# Altium project MRD104_MICROBOARD_APPS_A.PrjPcb (part 2 of 2)

## Sheet 0003_Page 3.SchDoc
size 553 x 426 mm
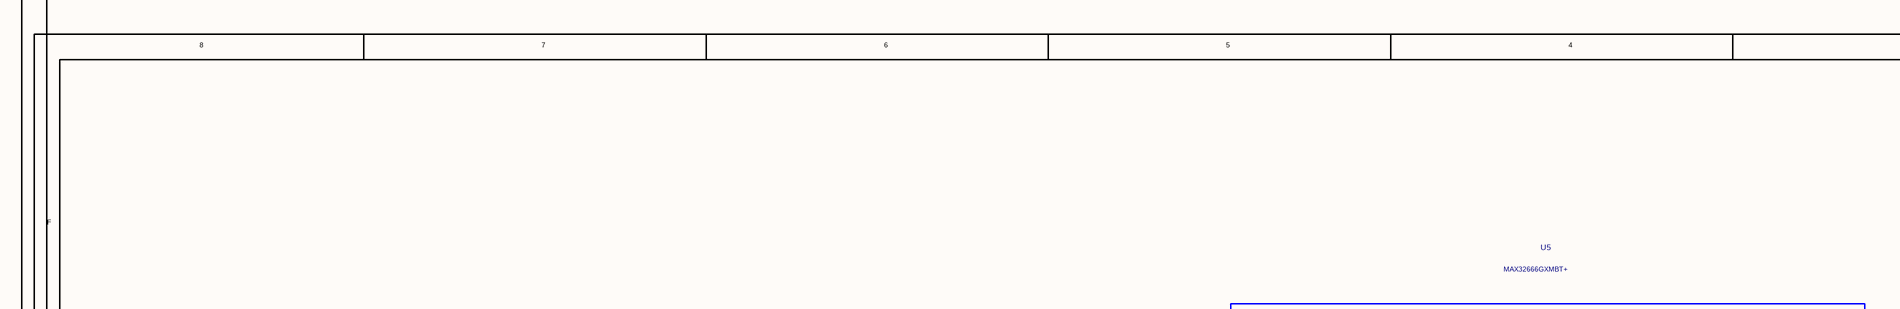
[diagram p7: 0003_Page 3.SchDoc, top left]
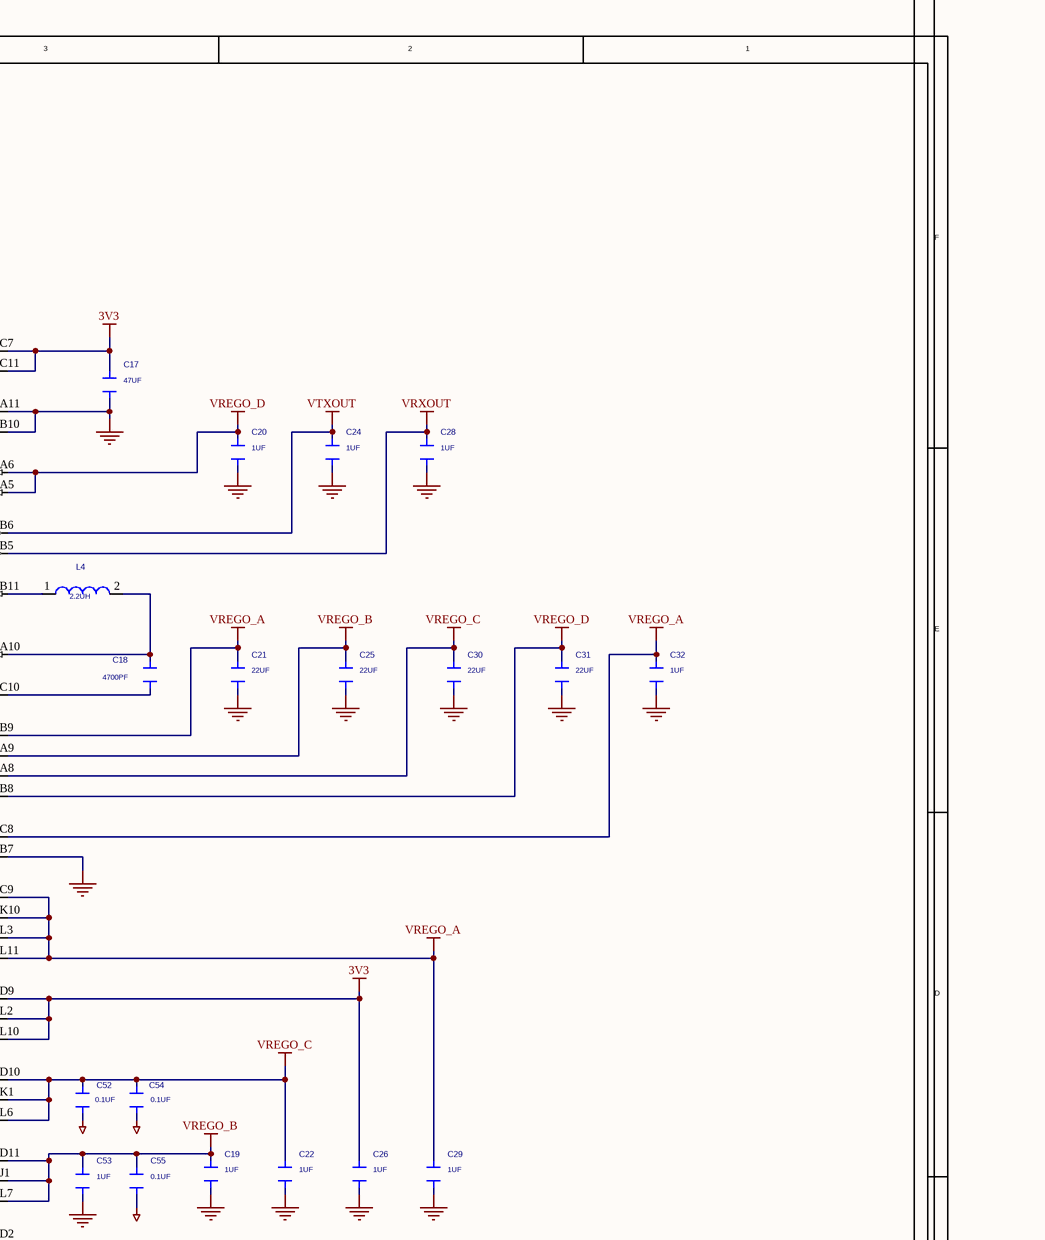
[diagram p8: 0003_Page 3.SchDoc, top middle]
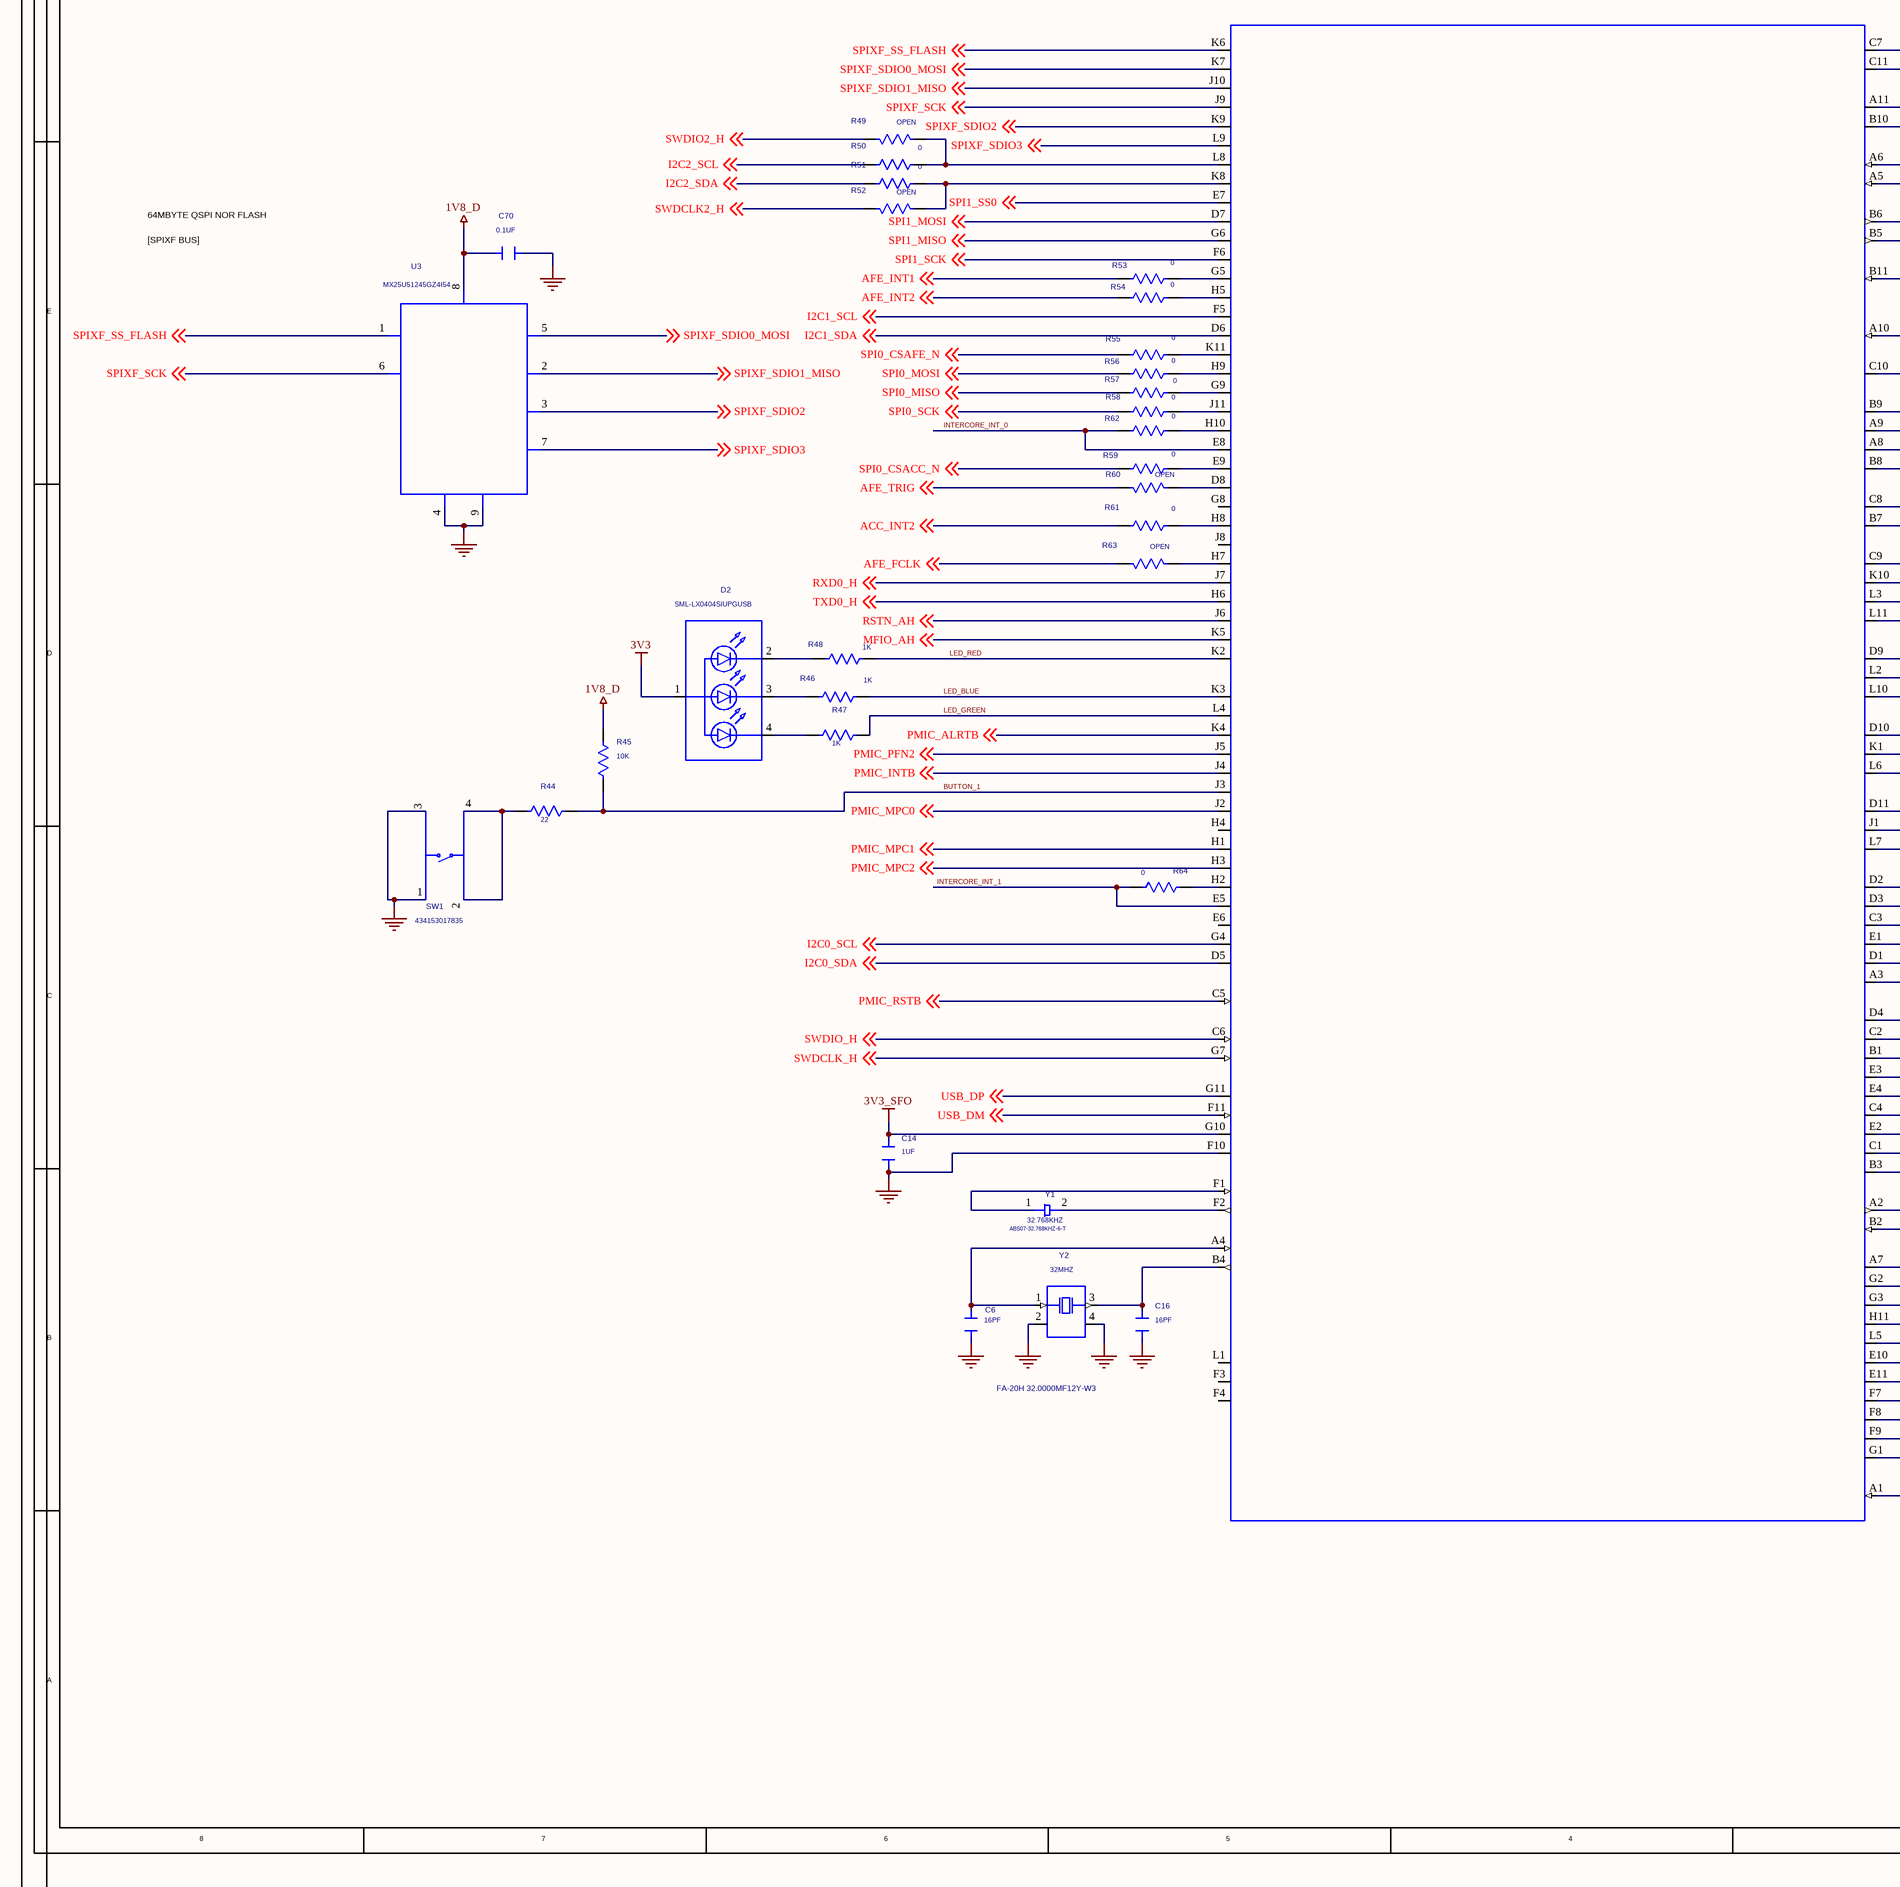
[diagram p9: 0003_Page 3.SchDoc, bottom left]
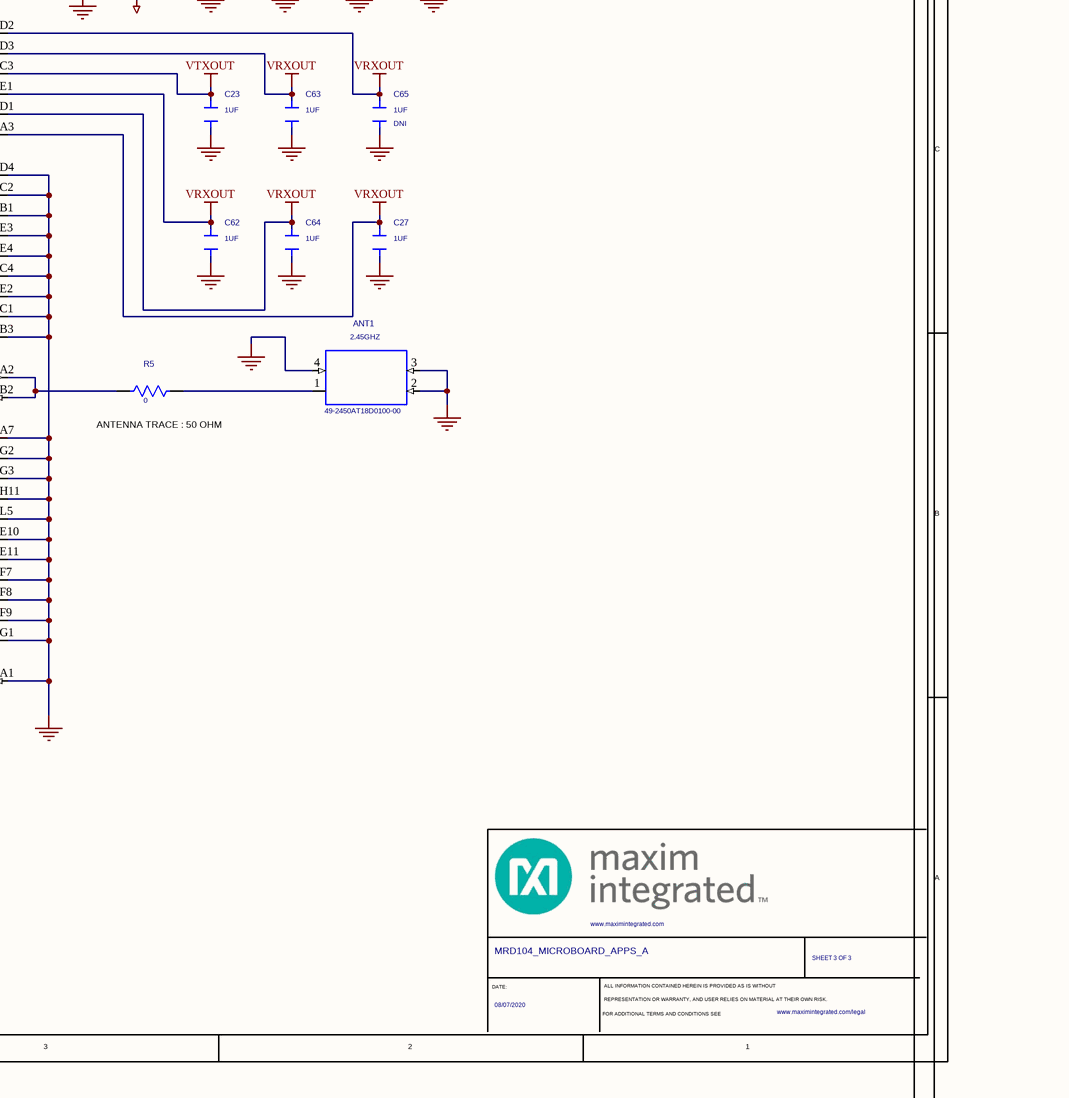
[diagram p10: 0003_Page 3.SchDoc, bottom middle]
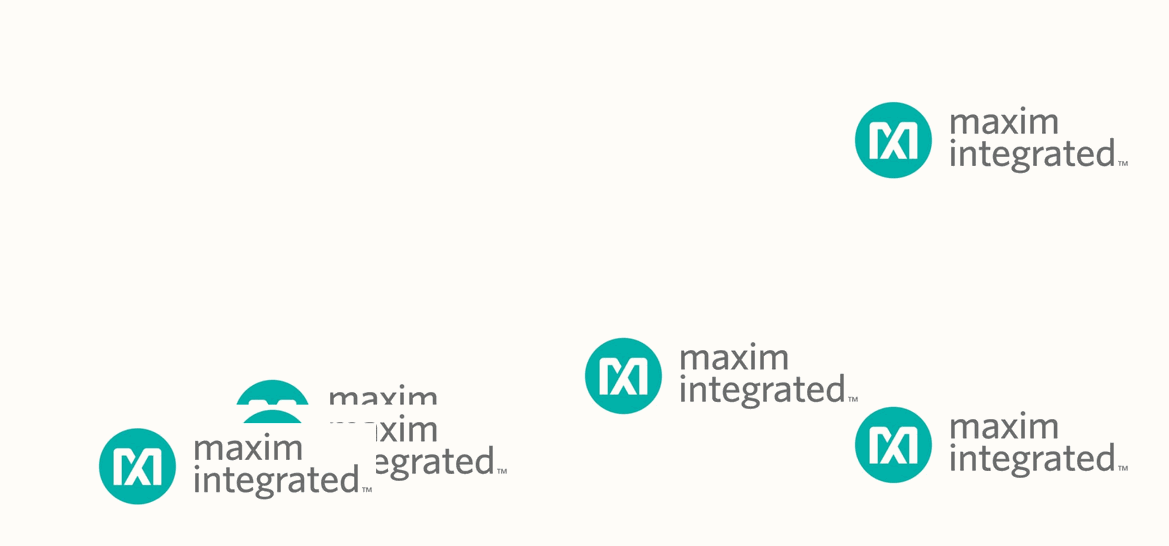
[diagram p11: 0003_Page 3.SchDoc, bottom right]

### Parts
(Parts that share a designator on the sheet are numbered #1, #2 ... from top to bottom, then left to right.)
*#3  CUSTOM_TXT_CDS21: SHEET 3 OF 3  DATE: 08/07/2020  PROJECT_TITLE: MRD104_MICROBOARD_APPS_A  (hidden comment: MAXIM_C_SIZE_CF)  (graphical)
*?  CUSTOM_TXT_CDS21: SHEET 3 OF 3  DATE: 08/07/2020  PROJECT_TITLE: MRD104_MICROBOARD_APPS_A  (hidden comment: MAXIM_C_SIZE_CF)  (graphical)
ANT1  2.45GHZ  MAXINV: 49-2450AT18D0100-00  [ANT_2450AT18D0100]
C6  16PF  [CAPC0603X33M]
C14  1UF  [CAPC0603X33M]
C16  16PF  [CAPC0603X33M]
C17  47UF  [CAPC2012X140M]
C18  4700PF  [CAPC0603X33M]
C19  1UF  [0402]
C20  1UF  [0402]
C21  22UF  [0603]
C22  1UF  [0402]
C23  1UF  [0402]
C24  1UF  [0402]
C25  22UF  [0603]
C26  1UF  [0402]
C27  1UF  [0402]
C28  1UF  [0402]
C29  1UF  [0402]
C30  22UF  [0603]
C31  22UF  [0603]
C32  1UF  [0402]
C52  0.1UF  [CAPC0603X33M]
C53  1UF  [0402]
C54  0.1UF  [CAPC0603X33M]
C55  0.1UF  [CAPC0603X33M]
C62  1UF  [0402]
C63  1UF  [0402]
C64  1UF  [0402]
C65  1UF  VARIANT: DNI  [0402]
C70  0.1UF  [CAPC0603X33M]
D2  SML-LX0404SIUPGUSB  [LED_LX0404]
L4  2.2UH  [0805]
R5  0  [0402]
R44  22  [0402]
R45  10K  [0402]
R46  1K  [0402]
R47  1K  [0402]
R48  1K  [0402]
R49  OPEN  [RESC0603X23L]
R50  0  [RESC0603X33M]
R51  0  [RESC0603X33M]
R52  OPEN  [RESC0603X23L]
R53  0  [RESC0603X33M]
R54  0  [RESC0603X33M]
R55  0  [RESC0603X33M]
R56  0  [RESC0603X33M]
R57  0  [RESC0603X33M]
R58  0  [RESC0603X33M]
R59  0  [RESC0603X33M]
R60  OPEN  [RESC0603X23L]
R61  0  [RESC0603X33M]
R62  0  [RESC0603X33M]
R63  OPEN  [RESC0603X23L]
R64  0  [RESC0603X33M]
SW1  434153017835  [SW_434153017835]
U3  MX25U51245GZ4I54  [SON127P600X800X80-9M]
U5  MAX32666GXMBT+  [MAXIM_21-0680]
Y1  32.768KHZ  MFG_PART_NUMBER: ABS07-32.768KHZ-6-T  [XTAL320X150X90M]
Y2  32MHZ  MFG_PART_NUMBER: FA-20H 32.0000MF12Y-W3  [OSCCC250X200X55M]

### Nets
1V8_D: C70.2 R45.2 U3.8(VCC)
3V3: C17.2 C26.2 D2.1(A) U5.C7(VREGI_1) U5.C11(VREGI_2) U5.D9(VDDIOH_1) U5.L2(VDDIOH_2) U5.L10(VDDIOH_3)
3V3_SFO: C14.2 U5.G10(VDDB)
GND_POWER: ANT1.2(GND_1) ANT1.3(GND_2) ANT1.4(GND_3) C6.1 C14.1 C16.1 C17.1 C19.1 C20.1 C21.1 C22.1 C23.1 C24.1 C25.1 C26.1 C27.1 C28.1 C29.1 C30.1 C31.1 C32.1 C52.1 C53.1 C54.1 C55.1 C62.1 C63.1 C64.1 C65.1 C70.1 SW1.1 SW1.3 U3.4(GND) U3.9(EP) U5.A1(GND) U5.A7(VSS) U5.A11(VSSPWR_1) U5.B1(VSSA_BT1) U5.B3(VSSA_BT5) U5.B7(VSSA) U5.B10(VSSPWR_2) U5.C1(VSSA_BT4) U5.C2(VSSA_BT1-1) U5.C4(VSSA_BT2) U5.D4(VSSA_BT0) U5.E2(VSSA_BT3) U5.E3(VSSA_BT0-1) U5.E4(VSSA_BT0-2) U5.E10(VSS_1) U5.E11(VSS_2) U5.F7(VSS_3) U5.F8(VSS_4) U5.F9(VSS_5) U5.F10(VSSB) U5.G1(VSS_6) U5.G2(VSS-1) U5.G3(VSS-2) U5.H11(VSS-3) U5.L5(VSS-4) Y2.2(NC1) Y2.4(NC2)
VREGO_A: C21.2 C29.2 C32.2 U5.B9(VREGO_A) U5.C8(VDDA) U5.C9(VDDIO_1) U5.K10(VDDIO_2) U5.L3(VDDIO_3) U5.L11(VDDIO_4)
VREGO_B: C19.2 C25.2 C53.2 C55.2 U5.A9(VREGO_B) U5.D11(VCOREB_1) U5.J1(VCOREB_2) U5.L7(VCOREB_3)
VREGO_C: C22.2 C30.2 C52.2 C54.2 U5.A8(VREGO_C) U5.D10(VCOREA_1) U5.K1(VCOREA_2) U5.L6(VCOREA_3)
VREGO_D: C20.2 C31.2 U5.A5(VRXIN) U5.A6(VTXIN) U5.B8(VREGO_D)
VRXOUT: C27.2 C28.2 C62.2 C63.2 C64.2 C65.2 U5.A3(VDD_BT5) U5.B5(VRXOUT) U5.D1(VDD_BT4) U5.D2(VDD_BT1) U5.D3(VDD_BT1-1) U5.E1(VDD_BT3)
VTXOUT: C23.2 C24.2 U5.B6(VTXOUT) U5.C3(VDD_BT2)
ACC_INT2: R61.1 ; off-sheet ACC_INT2
AFE_FCLK: R63.2 ; off-sheet AFE_FCLK
AFE_INT1: R53.1 ; off-sheet AFE_INT1
AFE_INT2: R54.1 ; off-sheet AFE_INT2
AFE_TRIG: R60.2 ; off-sheet AFE_TRIG
BUTTON_1: R44.2 R45.1 U5.J3(P1.6)
I2C0_SCL: U5.G4(P1.14) ; off-sheet I2C0_SCL
I2C0_SDA: U5.D5(P1.15) ; off-sheet I2C0_SDA
I2C1_SCL: U5.F5(P0.14) ; off-sheet I2C1_SCL
I2C1_SDA: U5.D6(P0.15) ; off-sheet I2C1_SDA
I2C2_SCL: R50.1 ; off-sheet I2C2_SCL
I2C2_SDA: R51.1 ; off-sheet I2C2_SDA
INTERCORE_INT_0: R62.1 U5.E8(P0.21)
INTERCORE_INT_1: R64.1 U5.E5(P1.12)
LED_BLUE: R46.2 U5.K3(P1.1)
LED_GREEN: R47.2 U5.L4(P1.2)
LED_RED: R48.2 U5.K2(P1.0_1)
MFIO_AH: U5.K5(P0.31) ; off-sheet MFIO_AH
PMIC_ALRTB: U5.K4(P1.3) ; off-sheet PMIC_ALRTB
PMIC_INTB: U5.J4(P1.5) ; off-sheet PMIC_INTB
PMIC_MPC0: U5.J2(P1.7) ; off-sheet PMIC_MPC0
PMIC_MPC1: U5.H1(P1.9) ; off-sheet PMIC_MPC1
PMIC_MPC2: U5.H3(P1.10) ; off-sheet PMIC_MPC2
PMIC_PFN2: U5.J5(P1.4) ; off-sheet PMIC_PFN2
PMIC_RSTB: U5.C5(RSTN) ; off-sheet PMIC_RSTB
RSTN_AH: U5.J6(P0.30) ; off-sheet RSTN_AH
RXD0_H: U5.J7(P0.28) ; off-sheet RXD0_H
SPI0_CSACC_N: R59.1 ; off-sheet SPI0_CSACC_N
SPI0_CSAFE_N: R55.1 ; off-sheet SPI0_CSAFE_N
SPI0_MISO: R57.1 ; off-sheet SPI0_MISO
SPI0_MOSI: R56.1 ; off-sheet SPI0_MOSI
SPI0_SCK: R58.1 ; off-sheet SPI0_SCK
SPI1_MISO: U5.G6(P0.10) ; off-sheet SPI1_MISO
SPI1_MOSI: U5.D7(P0.9) ; off-sheet SPI1_MOSI
SPI1_SCK: U5.F6(P0.11) ; off-sheet SPI1_SCK
SPI1_SS0: U5.E7(P0.8) ; off-sheet SPI1_SS0
SPIXF_SCK: U3.6(SCLK) U5.J9(P0.3) ; off-sheet SPIXF_SCK
SPIXF_SDIO0_MOSI: U3.5(SI/SIO0) U5.K7(P0.1) ; off-sheet SPIXF_SDIO0_MOSI
SPIXF_SDIO1_MISO: U3.2(SO/SIO1) U5.J10(P0.2) ; off-sheet SPIXF_SDIO1_MISO
SPIXF_SDIO2: U3.3(SIO2) U5.K9(P0.4) ; off-sheet SPIXF_SDIO2
SPIXF_SDIO3: U3.7(SIO3) U5.L9(P0.5) ; off-sheet SPIXF_SDIO3
SPIXF_SS_FLASH: U3.1(CS#) U5.K6(P0.0) ; off-sheet SPIXF_SS_FLASH
SWDCLK2_H: R52.2 ; off-sheet SWDCLK2_H
SWDCLK_H: U5.G7(SWCLK) ; off-sheet SWDCLK_H
SWDIO2_H: R49.2 ; off-sheet SWDIO2_H
SWDIO_H: U5.C6(SWDIO) ; off-sheet SWDIO_H
TXD0_H: U5.H6(P0.29) ; off-sheet TXD0_H
USB_DM: U5.F11(DM) ; off-sheet USB_DM
USB_DP: U5.G11(DP) ; off-sheet USB_DP
NetANT1_1: ANT1.1(FEED) R5.2
NetC6_2: C6.2 U5.A4(HFXIN) Y2.1(P1)
NetC16_2: C16.2 U5.B4(HFXOUT) Y2.3(P2)
NetC18_1: C18.1 U5.C10(VBST)
NetC18_2: C18.2 L4.2 U5.A10(LXB)
NetD2_2: D2.2(KR) R48.1
NetD2_3: D2.3(KB) R46.1
NetD2_4: D2.4(KG) R47.1
NetL4_1: L4.1 U5.B11(LXA)
NetR5_1: R5.1 U5.A2(ANT_THRU) U5.B2(ANT)
NetR44_1: R44.1 SW1.2 SW1.4
NetR49_1: R49.1 R50.2 U5.L8(P0.6)
NetR51_2: R51.2 R52.1 U5.K8(P0.7)
NetR53_2: R53.2 U5.G5(P0.12)
NetR54_2: R54.2 U5.H5(P0.13)
NetR55_2: R55.2 U5.K11(P0.16)
NetR56_2: R56.2 U5.H9(P0.17)
NetR57_2: R57.2 U5.G9(P0.18)
NetR58_2: R58.2 U5.J11(P0.19)
NetR59_2: R59.2 U5.E9(P0.22)
NetR60_1: R60.1 U5.D8(P0.23)
NetR61_2: R61.2 U5.H8(P0.25)
NetR62_2: R62.2 U5.H10(P0.20)
NetR63_1: R63.1 U5.H7(P0.27)
NetR64_2: R64.2 U5.H2(P1.11)
NetU5_F1: U5.F1(32KIN) Y1.1(P1)
NetU5_F2: U5.F2(32KOUT) Y1.2(P2)

Not connected (* = marked no-connect by the designer): U5 E6(P1.13) F3(DNC-1) F4(DNC-2) G8(P0.24) H4(P1.8) J8(P0.26) L1(NC)

### Notes on the sheet
- 64MBYTE QSPI NOR FLASH
- [SPIXF BUS]
- (near R5) ANTENNA TRACE : 50 OHM
- (in symbol MAXIM_C_SIZE_CF) D; C; B; A; DATE:; ALL INFORMATION CONTAINED HEREIN IS PROVIDED AS IS WITHOUT; REPRESENTATION OR WARRANTY, AND USER RELIES ON MATERIAL AT THEIR OWN RISK.; FOR ADDITIONAL TERMS AND CONDITIONS SEE; 8; 7; 6; 5; 4; 2; 1; F; E; 3

### Library data of the parts
*#3 = MAXIM_C_SIZE_CF: OriginalSymbolOrigin: (-9396,8292); COMMENT_BODY: TRUE; Page Number: 3; CURRENT_DESIGN_SHEET: Page 3; WEBLINK1: www.maximintegrated.com; LEAGAL_WEBLINK: www.maximintegrated.com/legal
*? = MAXIM_C_SIZE_CF: OriginalSymbolOrigin: (-9396,8292); COMMENT_BODY: TRUE; Page Number: 2; CURRENT_DESIGN_SHEET: Page 2; WEBLINK1: www.maximintegrated.com; LEAGAL_WEBLINK: www.maximintegrated.com/legal
ANT1 = ANTENNA: ANTENNA; DETUNING RESILIENT; SMT; EIA 1210; DETUNING RESILIENT; EDGE MOUNT DESIGN; 2.45GHZ; MFG_PART_NUMBER: 2450AT18D0100; MANUFACTURER: JOHANSON TECHNOLOGY; OriginalSymbolOrigin: (-150,125); PACK_TYPE: SMD_4_1; DRAWING: @MRD104_MICROBOARD_APPS_A_LIB.MRD104_MICROBOARD_APPS_A(SCH_1):PAGE3; PHYS_PAGE: 3; TEMP_RANGE: -40 DEGC TO +125 DEGC; PCB Footprint_CDS: ANT_2450AT18D0100; SEC_TYPE: SMD_4_1; TOLERANCE: N/A; VER: 3; VOLTAGE_RATING: N/A
C6 C16 = CAP_NP: CAP; SMT (0201); 16PF; 5%; 50V; C0G; CERAMIC; MFG_PART_NUMBER: GRM0335C1H160JA01; MANUFACTURER: MURATA; OriginalSymbolOrigin: (-50,50); PACK_TYPE: 0201CAPM; MAXINV: EC111000004322; CAP: 1.60E-11; DRAWING: @MRD104_MICROBOARD_APPS_A_LIB.MRD104_MICROBOARD_APPS_A(SCH_1):PAGE3; PHYS_PAGE: 3; VER: 2; TEMP_RANGE: -55 DEGC TO +125 DEGC; VLOG_PARAM01: CAP:INTEGER; PCB Footprint_CDS: CAPC0603X33M; CASE: SMT (0201); TOLERANCE: 5%; VOLTAGE_RATING: 50V
C14 = CAP_NP: CAP; SMT (0201); 1UF; 20%; 10V; X5R; CERAMIC; MFG_PART_NUMBER: GRM033R61A105ME15; MANUFACTURER: MURATA; OriginalSymbolOrigin: (-50,50); PACK_TYPE: 0201CAPM; MAXINV: 20-0001U-AA20; CAP: 1.00E-06; DRAWING: @MRD104_MICROBOARD_APPS_A_LIB.MRD104_MICROBOARD_APPS_A(SCH_1):PAGE3; PHYS_PAGE: 3; VER: 2; TEMP_RANGE: -55 DEGC TO +85 DEGC; VLOG_PARAM01: CAP:INTEGER; PCB Footprint_CDS: CAPC0603X33M; CASE: SMT (0201); TOLERANCE: 20%; VOLTAGE_RATING: 10V
C17 = CAP_NP: CAP; SMT (0805); 47UF; 20%; 10V; X5R; CERAMIC; MFG_PART_NUMBER: GRM21BR61A476ME15; MANUFACTURER: MURATA; OriginalSymbolOrigin: (-50,50); PACK_TYPE: 0805CAP; MAXINV: 20-0047U-A38; CAP: 4.70E-05; DRAWING: @MRD104_MICROBOARD_APPS_A_LIB.MRD104_MICROBOARD_APPS_A(SCH_1):PAGE3; PHYS_PAGE: 3; VER: 2; TEMP_RANGE: -55 DEGC TO +85 DEGC; VLOG_PARAM01: CAP:INTEGER; PCB Footprint_CDS: CAPC2012X140M; CASE: SMT (0805); TOLERANCE: 20%; VOLTAGE_RATING: 10V
C18 = CAP_NP: CAP; SMT (0201); 4700PF; 20%; 25V; X5R; CERAMIC; MFG_PART_NUMBER: GRM033R61E472MA12; MANUFACTURER: MURATA; OriginalSymbolOrigin: (-50,50); PACK_TYPE: 0201CAPM; MAXINV: EC111000003909; CAP: 4.70E-09; DRAWING: @MRD104_MICROBOARD_APPS_A_LIB.MRD104_MICROBOARD_APPS_A(SCH_1):PAGE3; PHYS_PAGE: 3; VER: 2; TEMP_RANGE: -55 DEGC TO +85 DEGC; VLOG_PARAM01: CAP:INTEGER; PCB Footprint_CDS: CAPC0603X33M; CASE: SMT (0201); TOLERANCE: 20%; VOLTAGE_RATING: 25V
C19 C20 C22-C24 C26-C29 C32 C53 C62-C65 = CAP_NP: CAP; SMT (0402); 1UF; 10%; 10V; X5R; CERAMIC; MFG_PART_NUMBER: C0402C105K8PAC;CC0402KRX5R6BB105; MANUFACTURER: KEMET;YAGEO; OriginalSymbolOrigin: (-50,50); PACK_TYPE: 0402CAP; MAXINV: 20-0001U-B8; CAP: 1.00E-06; DRAWING: @MRD104_MICROBOARD_APPS_A_LIB.MRD104_MICROBOARD_APPS_A(SCH_1):PAGE3; PHYS_PAGE: 3; VER: 2; TEMP_RANGE: -55 DEGC TO +85 DEGC; VLOG_PARAM01: CAP:INTEGER; PCB Footprint_CDS: 0402; CASE: SMT (0402); TOLERANCE: 10%; VOLTAGE_RATING: 10V
C21 C25 C30 C31 = CAP_NP: CAP; SMT (0603); 22UF; 20%; 16V; X5R; CERAMIC; MFG_PART_NUMBER: CL10A226MO7JZNC; MANUFACTURER: SAMSUNG ELECTRONICS; OriginalSymbolOrigin: (-50,50); PACK_TYPE: 0603CAP; MAXINV: 20-0022U-A29; CAP: 2.20E-05; DRAWING: @MRD104_MICROBOARD_APPS_A_LIB.MRD104_MICROBOARD_APPS_A(SCH_1):PAGE3; PHYS_PAGE: 3; VER: 2; TEMP_RANGE: -55 DEGC TO +85 DEGC; VLOG_PARAM01: CAP:INTEGER; PCB Footprint_CDS: 0603; CASE: SMT (0603); TOLERANCE: 20%; VOLTAGE_RATING: 16V
C52 C54 C55 = CAP_NP: CAP; SMT (0201); 0.1UF; 10%; 16V; X7S; CERAMIC; MFG_PART_NUMBER: GRM033C71C104KE14; MANUFACTURER: MURATA; OriginalSymbolOrigin: (-50,50); PACK_TYPE: 0201CAPM; MAXINV: 20-000U1-BA99; CAP: 1.00E-07; DRAWING: @MRD104_MICROBOARD_APPS_A_LIB.MRD104_MICROBOARD_APPS_A(SCH_1):PAGE3; PHYS_PAGE: 3; VER: 2; TEMP_RANGE: -55 DEGC TO +125 DEGC; VLOG_PARAM01: CAP:INTEGER; PCB Footprint_CDS: CAPC0603X33M; CASE: SMT (0201); TOLERANCE: 10%; VOLTAGE_RATING: 16V
C70 = CAP_NP: CAP; SMT (0201); 0.1UF; 10%; 10V; X5R; CERAMIC; MFG_PART_NUMBER: C0603X5R1A104K030BC; MANUFACTURER: TDK; OriginalSymbolOrigin: (-50,50); PACK_TYPE: 0201CAPM; MAXINV: 20-000U1-61; CAP: 1.00E-07; DRAWING: @MRD104_MICROBOARD_APPS_A_LIB.MRD104_MICROBOARD_APPS_A(SCH_1):PAGE3; PHYS_PAGE: 3; VER: 2; TEMP_RANGE: -55 DEGC TO +85 DEGC; VLOG_PARAM01: CAP:INTEGER; PCB Footprint_CDS: CAPC0603X33M; CASE: SMT (0201); TOLERANCE: 10%; VOLTAGE_RATING: 10V
D2 = LED_4P#1: DIODE; LED; SML; FULL COLOR; WATER CLEAR LENS; RED-GREEN-BLUE; SMT; VF=2.95V; IF=0.1A; MANUFACTURER: LUMEX OPTOCOMPONENTS INC; OriginalSymbolOrigin: (-150,275); PACK_TYPE: LX0404; MAXINV: 30-SMLLX0404SIUPGUSB-00; DRAWING: @MRD104_MICROBOARD_APPS_A_LIB.MRD104_MICROBOARD_APPS_A(SCH_1):PAGE3; PHYS_PAGE: 3; VER: 7; VOLTAGE_RATING: 2.95V; TEMP_RANGE: -40 DEGC TO +85 DEGC; PCB Footprint_CDS: LED_LX0404; MFG_PART_NUMBER: SML-LX0404SIUPGUSB; TOLERANCE: N/A
L4 = INDUCT: INDUCTOR; SMT (0805); FERRITE; 2.2UH; 20%; 1A; MFG_PART_NUMBER: MLP2012H2R2MT0S1; MANUFACTURER: TDK; OriginalSymbolOrigin: (-100,50); MAXINV: 50-002U2-OXF; DRAWING: @MRD104_MICROBOARD_APPS_A_LIB.MRD104_MICROBOARD_APPS_A(SCH_1):PAGE3; PHYS_PAGE: 3; VER: 1; TEMP_RANGE: -40 DEGC TO +125 DEGC; PACK_TYPE: 0805; PCB Footprint_CDS: 0805; CASE: SMT (0805); TOLERANCE: 20%
R5 = RES_SMD: RES; SMT (0402); 0; JUMPER; JUMPER; 0.1000W; MFG_PART_NUMBER: ERJ-2GE0R00; MANUFACTURER: PANASONIC; OriginalSymbolOrigin: (-75,50); PACK_TYPE: 0402RES; MAXINV: 80-0000R-26A; DRAWING: @MRD104_MICROBOARD_APPS_A_LIB.MRD104_MICROBOARD_APPS_A(SCH_1):PAGE3; PHYS_PAGE: 3; POWER_RATING: 0.10W; RES: 0.00000001E00; TOLERANCE: 0%; VER: 2; TEMP_RANGE: -55 DEGC TO +155 DEGC; VLOG_PARAM01: RES:INTEGER; PCB Footprint_CDS: 0402; CASE: SMT (0402)
R44 = RES_SMD: RES; SMT (0402); 22; 5%; +/-200PPM/DEGC; 0.1000W; MFG_PART_NUMBER: ERJ-2GEJ220; MANUFACTURER: PANASONIC; OriginalSymbolOrigin: (-75,50); PACK_TYPE: 0402RES; MAXINV: 80-0022R-Q6; DRAWING: @MRD104_MICROBOARD_APPS_A_LIB.MRD104_MICROBOARD_APPS_A(SCH_1):PAGE3; PHYS_PAGE: 3; POWER_RATING: 0.10W; RES: 2.20E01; VER: 2; TEMP_RANGE: -55 DEGC TO +155 DEGC; MATERIAL_TYPE: THICK FILM; VLOG_PARAM01: RES:INTEGER; PCB Footprint_CDS: 0402; CASE: SMT (0402); TOLERANCE: 5%
R45 = RES_SMD: RES; SMT (0402); 10K; 1%; +/-100PPM/DEGC; 0.0630W; MFG_PART_NUMBER: CRCW040210K0FK;RC0402FR-0710KL; MANUFACTURER: VISHAY DALE;YAGEO PHICOMP; OriginalSymbolOrigin: (-75,50); PACK_TYPE: 0402RES; MAXINV: 80-0010K-23; DRAWING: @MRD104_MICROBOARD_APPS_A_LIB.MRD104_MICROBOARD_APPS_A(SCH_1):PAGE3; PHYS_PAGE: 3; POWER_RATING: 0.0625W; RES: 1.00E04; VER: 2; TEMP_RANGE: -55 DEGC TO +155 DEGC; VLOG_PARAM01: RES:INTEGER; PCB Footprint_CDS: 0402; CASE: SMT (0402); TOLERANCE: 1%
R46 R48 = RES_SMD: RES; SMT (0402); 1K; 0.10%; +/-25PPM/DEGC; 0.1000W; MFG_PART_NUMBER: TNPW04021K00BE; MANUFACTURER: VISHAY DALE; OriginalSymbolOrigin: (-75,50); PACK_TYPE: 0402RES; MAXINV: 80-0001K-CA54; DRAWING: @MRD104_MICROBOARD_APPS_A_LIB.MRD104_MICROBOARD_APPS_A(SCH_1):PAGE3; PHYS_PAGE: 3; POWER_RATING: 0.1W; RES: 1.00E03; TOLERANCE: 0.1%; VER: 2; TEMP_RANGE: -55 DEGC TO +155 DEGC; MATERIAL_TYPE: THIN FILM; VLOG_PARAM01: RES:INTEGER; PCB Footprint_CDS: 0402; CASE: SMT (0402)
R47 = RES_SMD: RES; SMT (0402); 1K; 0.10%; +/-25PPM/DEGC; 0.1000W; MFG_PART_NUMBER: TNPW04021K00BE; MANUFACTURER: VISHAY DALE; OriginalSymbolOrigin: (-75,50); PACK_TYPE: 0402RES; MAXINV: 80-0001K-CA54; DRAWING: @MRD104_MICROBOARD_APPS_A_LIB.MRD104_MICROBOARD_APPS_A(SCH_1):PAGE3; PHYS_PAGE: 3; POWER_RATING: 0.1W; RES: 1.00E03; TOLERANCE: 0.1%; VER: 2; TEMP_RANGE: -55 DEGC TO +155 DEGC; VLOG_PARAM01: RES:INTEGER; MATERIAL_TYPE: THIN FILM; PCB Footprint_CDS: 0402; CASE: SMT (0402)
R49 R52 R60 R63 = EK_RES_SMD: RESISTOR; 0201; OPEN; FORMFACTOR; OriginalSymbolOrigin: (-75,50); PACK_TYPE: 0201_FF; DRAWING: @MRD104_MICROBOARD_APPS_A_LIB.MRD104_MICROBOARD_APPS_A(SCH_1):PAGE3; PHYS_PAGE: 3; VER: 2; MAXINV: N/A; PCB Footprint_CDS: RESC0603X23L; CASE: SMT (0201); MFG_PART_NUMBER: N/A; POWER_RATING: N/A; RES: N/A; TOLERANCE: N/A; MANUFACTURER: N/A; TEMP_RANGE: N/A; VLOG_PARAM01: N/A
R50 R51 R53-R59 R61 R62 R64 = RES_SMD: RES; SMT (0201); 0; 1%; JUMPER; 0.0500W; MANUFACTURER: VISHAY DALE;PANASONIC; OriginalSymbolOrigin: (-75,50); PACK_TYPE: 0201RES; MAXINV: 80-0000R-95; DRAWING: @MRD104_MICROBOARD_APPS_A_LIB.MRD104_MICROBOARD_APPS_A(SCH_1):PAGE3; PHYS_PAGE: 3; POWER_RATING: 0.05W; RES: 0.00000001E00; VER: 2; TEMP_RANGE: -55 DEGC TO +155 DEGC; VLOG_PARAM01: RES:INTEGER; PCB Footprint_CDS: RESC0603X33M; TOLERANCE: 1%
SW1 = 434153017835: SWITCH; SPST; SMT; 12V; 0.05A;WS-TASV J-BEND TACT SWITCH; RCONTACT=0.1 OHM; RINSULATION=100M OHM; MANUFACTURER: WURTH ELECTRONICS INC; OriginalSymbolOrigin: (-225,75); MAXINV: EH111000004113; DRAWING: @MRD104_MICROBOARD_APPS_A_LIB.MRD104_MICROBOARD_APPS_A(SCH_1):PAGE3; PHYS_PAGE: 3; VER: 1; VOLTAGE_RATING: +12V; TEMP_RANGE: -40 DEGC TO +85 DEGC; PACK_TYPE: SMT; PCB Footprint_CDS: SW_434153017835; MFG_PART_NUMBER: 434153017835; SEC_TYPE: SMT; TOLERANCE: N/A
U3 = MX25U51245G_54: IC; MMRY; CMOS MXSMIO; SERIAL MULTI I/O; FLASH MEMORY; WSON8-EP; MANUFACTURER: MACRONIX INTERNATIONAL CO LTD; OriginalSymbolOrigin: (-300,450); MAXINV: EQ111000004114; DRAWING: @MRD104_MICROBOARD_APPS_A_LIB.MRD104_MICROBOARD_APPS_A(SCH_1):PAGE3; PHYS_PAGE: 3; VER: 1; VOLTAGE_RATING: +1.65V TO +2.0V; TEMP_RANGE: -40 DEGC TO +85 DEGC; PACK_TYPE: WSON8-EP; PCB Footprint_CDS: SON127P600X800X80-9M; CASE: WSON8-EP; MFG_PART_NUMBER: MX25U51245GZ4I54; SEC_TYPE: WSON8-EP; TOLERANCE: N/A
U5 = MAX32666: IC; UCON; LOW-POWER ARM CORTEX-M4 WITH FPU-BASED; MICROCONTROLLER WITH BLUETOOTH 5 FOR WEARABLES; BGA121; MANUFACTURER: MAXIM; OriginalSymbolOrigin: (-1250,2950); MAXINV: 10-MAX32666GXMBT-B; DRAWING: @MRD104_MICROBOARD_APPS_A_LIB.MRD104_MICROBOARD_APPS_A(SCH_1):PAGE3; PHYS_PAGE: 3; VER: 4; VOLTAGE_RATING: +1.1V; TEMP_RANGE: -40 DEGC TO +105 DEGC; PACK_TYPE: BGA121; PCB Footprint_CDS: MAXIM_21-0680; CASE: BGA121; MFG_PART_NUMBER: MAX32666GXMBT+; SEC_TYPE: BGA121; TOLERANCE: N/A
Y1 = XTAL#1: CRYSTAL; SMT; 32.768KHZ; 6PF; TOL = +/-20PPM; STABILITY = -0.036PPM/T2; MANUFACTURER: ABRACON; OriginalSymbolOrigin: (-50,50); PACK_TYPE: ABS07; MAXINV: 60-32K76-0AL; DRAWING: @MRD104_MICROBOARD_APPS_A_LIB.MRD104_MICROBOARD_APPS_A(SCH_1):PAGE3; PHYS_PAGE: 3; VER: 1; TEMP_RANGE: -40 DEGC TO +85 DEGC; PCB Footprint_CDS: XTAL320X150X90M; SEC_TYPE: ABS07; TOLERANCE: N/A; VOLTAGE_RATING: N/A
Y2 = XTAL#2: CRYSTAL; SMT; 32MHZ; TOL = +/-10PPM; STABILITY = +/-12PPM; MANUFACTURER: EPSON; OriginalSymbolOrigin: (-75,125); PACK_TYPE: XTAL_FA-20H; MAXINV: 60-0032M-0EW; DRAWING: @MRD104_MICROBOARD_APPS_A_LIB.MRD104_MICROBOARD_APPS_A(SCH_1):PAGE3; PHYS_PAGE: 3; VER: 4; TEMP_RANGE: -40 DEGC TO +85 DEGC; PCB Footprint_CDS: OSCCC250X200X55M; SEC_TYPE: XTAL_FA-20H; TOLERANCE: N/A; VOLTAGE_RATING: N/A

## Nets that join several sheets
1V8_D: 0001_Page 1 (C44.2 L2.2 U1.F9), 0002_Page 2 (13 pins), 0003_Page 3 (C70.2 R45.2 U3.8)
1V8_S: 0001_Page 1 (U1.G5 U1.H6), 0002_Page 2 (8 pins)
3V3: 0001_Page 1 (6 pins), 0003_Page 3 (8 pins)
3V3_SFO: 0001_Page 1 (C3.1 U1.C8), 0002_Page 2 (11 pins), 0003_Page 3 (C14.2 U5.G10)
5V0_B: 0001_Page 1 (C40.2 C42.2 U1.B2 U1.C2), 0002_Page 2 (C11.2 J2.22 J2.23)
GND_POWER: 0001_Page 1 (32 pins), 0002_Page 2 (53 pins), 0003_Page 3 (61 pins)
USB_VBUS: 0001_Page 1 (C2.2 U1.E9), 0002_Page 2 (C56.2 C66.2 L8.2)
VREGO_A: 0001_Page 1 (7 pins), 0002_Page 2 (R19.2 R20.2 R75.2), 0003_Page 3 (9 pins)
ACC_INT2: 0002_Page 2 (5 pins), 0003_Page 3 (R61.1)
AFE_FCLK: 0002_Page 2 (R8.1 R30.2), 0003_Page 3 (R63.2)
AFE_INT1: 0002_Page 2 (J2.13 R35.2), 0003_Page 3 (R53.1)
AFE_INT2: 0002_Page 2 (R36.2 R77.2), 0003_Page 3 (R54.1)
AFE_TRIG: 0002_Page 2 (R12.1 R17.2 R38.2), 0003_Page 3 (R60.2)
I2C0_SCL: 0002_Page 2 (R25.1 U2.B6), 0003_Page 3 (U5.G4)
I2C0_SDA: 0002_Page 2 (R24.1 U2.A6), 0003_Page 3 (U5.D5)
I2C1_SCL: 0001_Page 1 (U1.F8), 0002_Page 2 (J1.5 R20.1), 0003_Page 3 (U5.F5)
I2C1_SDA: 0001_Page 1 (U1.E7), 0002_Page 2 (J1.2 R19.1), 0003_Page 3 (U5.D6)
I2C2_SCL: 0002_Page 2 (R21.1 R23.1), 0003_Page 3 (R50.1)
I2C2_SDA: 0002_Page 2 (R16.1 R18.2), 0003_Page 3 (R51.1)
MFIO_AH: 0002_Page 2 (R26.1), 0003_Page 3 (U5.K5)
PMIC_ALRTB: 0001_Page 1 (R43.1 U1.G7), 0003_Page 3 (U5.K4)
PMIC_INTB: 0001_Page 1 (R68.1 U1.E3), 0003_Page 3 (U5.J4)
PMIC_MPC0: 0001_Page 1 (R67.1 U1.B6), 0003_Page 3 (U5.J2)
PMIC_MPC1: 0001_Page 1 (R66.1 U1.B7), 0003_Page 3 (U5.H1)
PMIC_MPC2: 0001_Page 1 (R65.1 U1.C3), 0003_Page 3 (U5.H3)
PMIC_PFN2: 0001_Page 1 (R71.1 U1.D5), 0003_Page 3 (U5.J5)
PMIC_RSTB: 0001_Page 1 (R70.1 U1.E4), 0003_Page 3 (U5.C5)
RSTN_AH: 0002_Page 2 (C38.2 TP11.1 U2.C1), 0003_Page 3 (U5.J6)
RXD0_H: 0002_Page 2 (U9.C4), 0003_Page 3 (U5.J7)
SPI0_CSACC_N: 0002_Page 2 (J2.11 R31.1 U4.2), 0003_Page 3 (R59.1)
SPI0_CSAFE_N: 0002_Page 2 (J2.3 R34.1), 0003_Page 3 (R55.1)
SPI0_MISO: 0002_Page 2 (J2.5 R28.1 U4.3), 0003_Page 3 (R57.1)
SPI0_MOSI: 0002_Page 2 (J2.9 R33.1 U4.4), 0003_Page 3 (R56.1)
SPI0_SCK: 0002_Page 2 (J2.7 R29.1 U4.1), 0003_Page 3 (R58.1)
SPI1_MISO: 0002_Page 2 (U2.C3), 0003_Page 3 (U5.G6)
SPI1_MOSI: 0002_Page 2 (U2.D2), 0003_Page 3 (U5.D7)
SPI1_SCK: 0002_Page 2 (U2.D3), 0003_Page 3 (U5.F6)
SPI1_SS0: 0002_Page 2 (R72.1), 0003_Page 3 (U5.E7)
SWDCLK2_H: 0002_Page 2 (R41.1), 0003_Page 3 (R52.2)
SWDCLK_H: 0002_Page 2 (R42.2), 0003_Page 3 (U5.G7)
SWDIO2_H: 0002_Page 2 (R39.1), 0003_Page 3 (R49.2)
SWDIO_H: 0002_Page 2 (R40.2), 0003_Page 3 (U5.C6)
TXD0_H: 0002_Page 2 (U9.A3), 0003_Page 3 (U5.H6)
USB_DM: 0002_Page 2 (R9.2), 0003_Page 3 (U5.F11)
USB_DP: 0002_Page 2 (R10.2), 0003_Page 3 (U5.G11)